# EAGLE design stm8-hid (EAGLE 6.5.0)
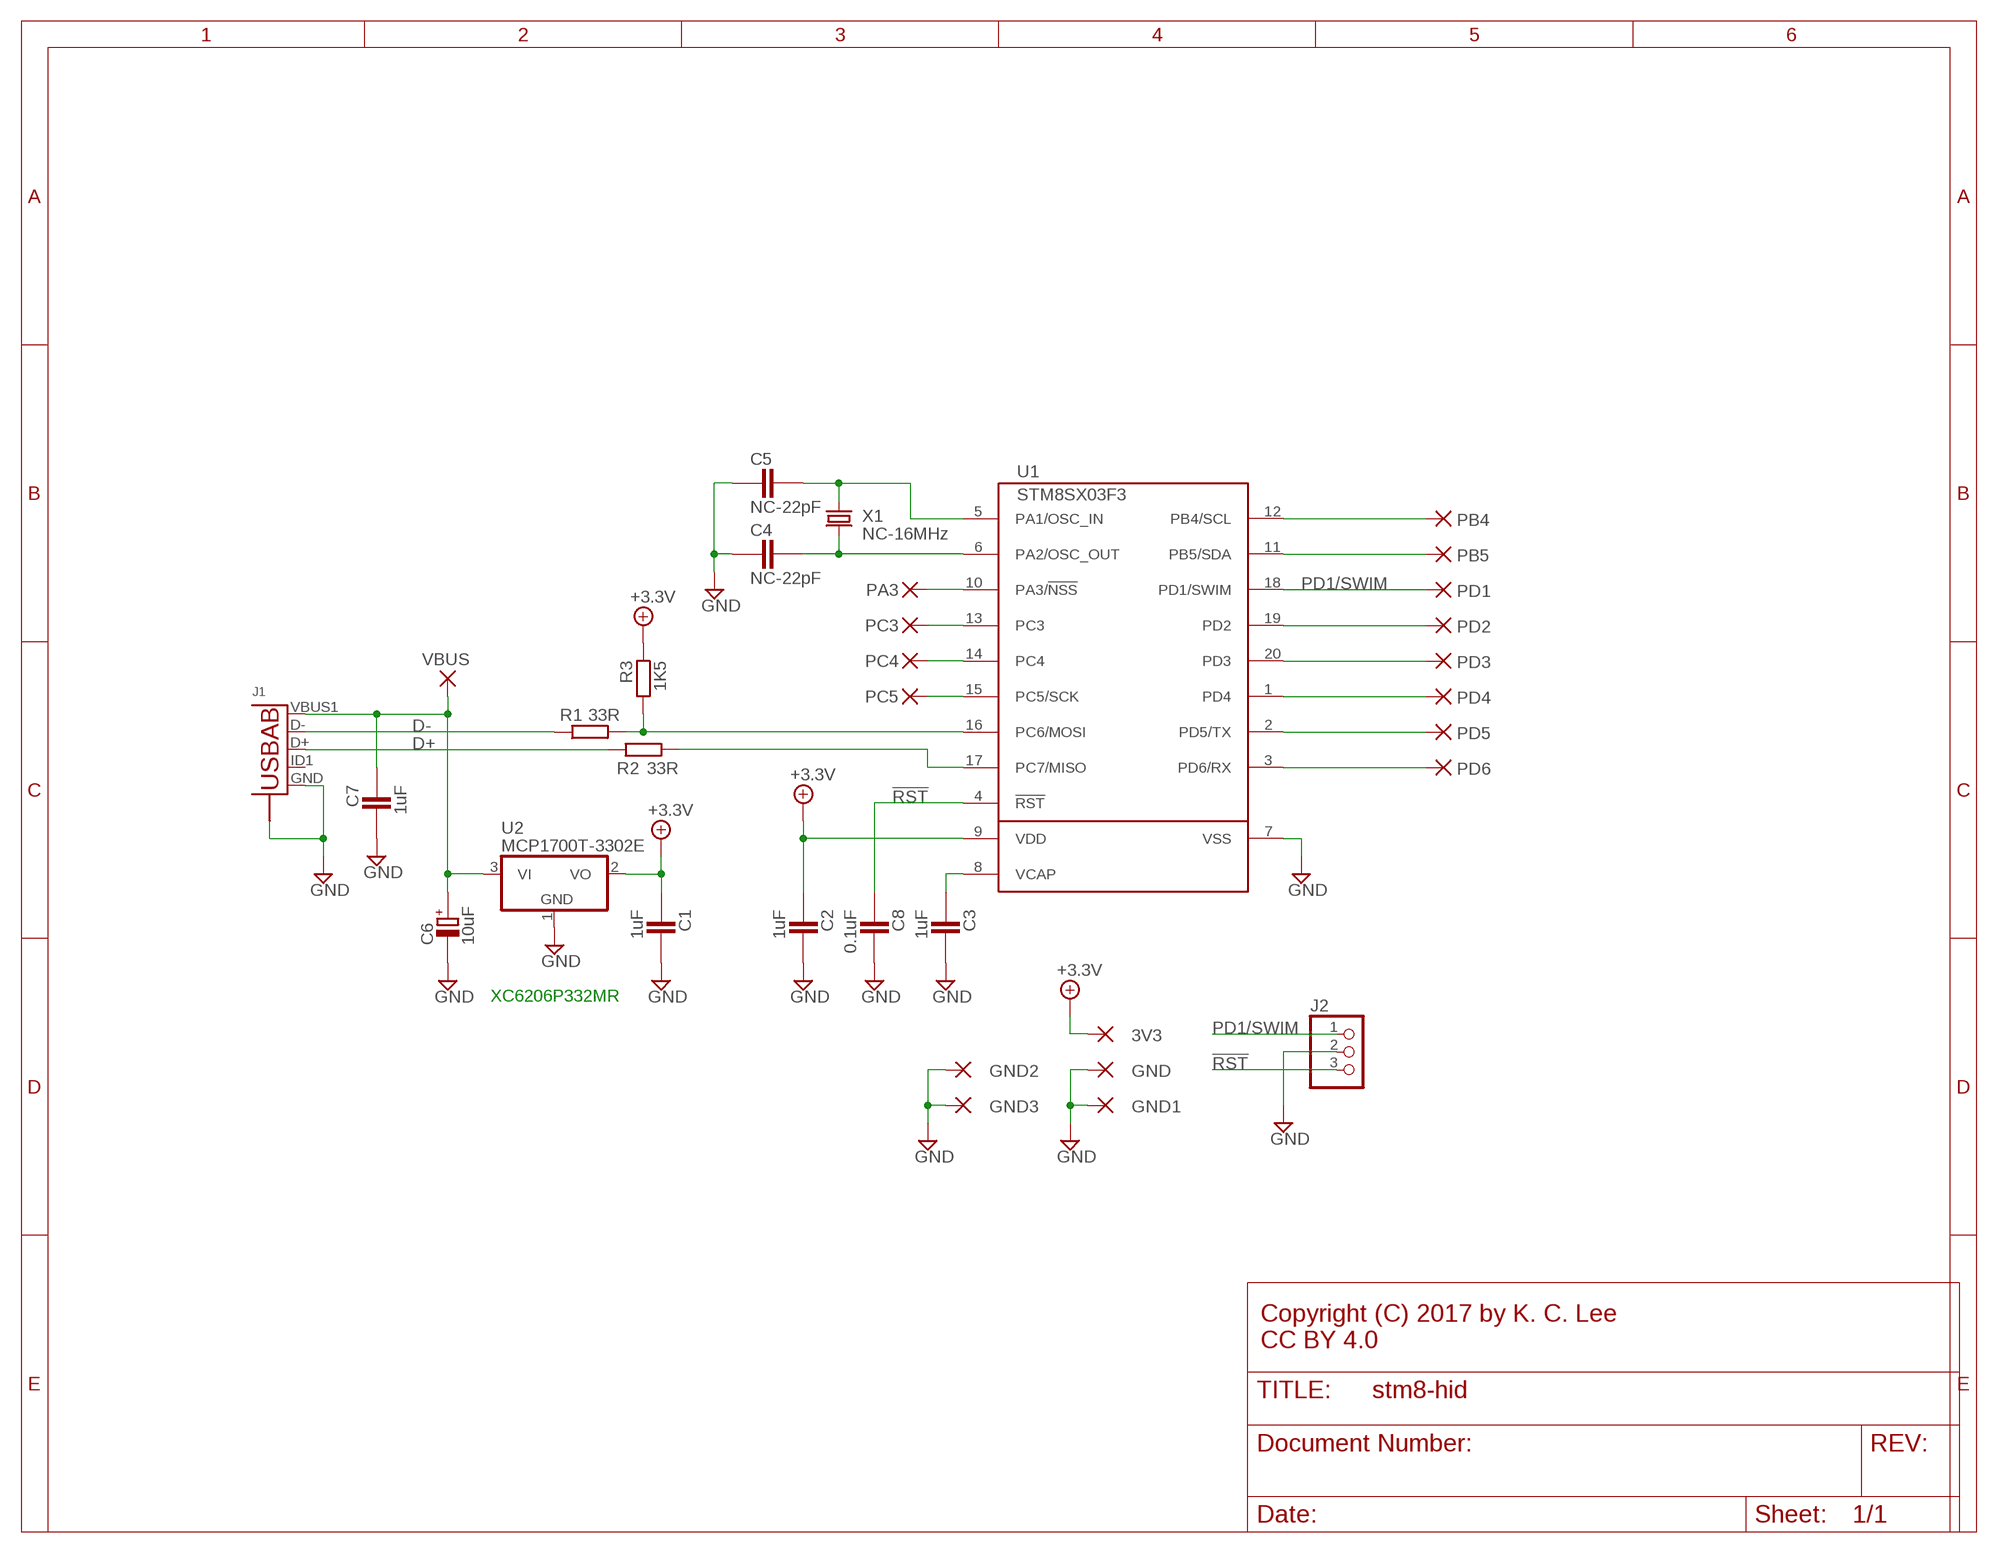
[diagram p0: schematic, sheet 1]

## Parts
3V3  SMD2  [SMD1,27-2,54]
C1  1uF  CAPACITOR_0603  [CAPC1608X92N]
C2  1uF  CAPACITOR_0603  [CAPC1608X92N]
C3  1uF  CAPACITOR_0603  [CAPC1608X92N]
C4  NC-22pF  CAPACITOR_0603  [CAPC1608X92N]
C5  NC-22pF  CAPACITOR_0603  [CAPC1608X92N]
C6  10uF  POLARISED_C_CASE  [CAPMP6032X280N]
C7  1uF  CAPACITOR_0603  [CAPC1608X92N]
C8  0.1uF  CAPACITOR_0603  [CAPC1608X92N]
GND  SMD2  [SMD1,27-2,54]
GND1  SMD2  [SMD1,27-2,54]
GND2  SMD2  [SMD1,27-2,54]
GND3  SMD2  [SMD1,27-2,54]
J1  USB-ABBG-ORG  [USB-AB-MICRO-SMD_V03_SMT]
J2  PINHD-1X3_2.54  [1X03]
PA3  SMD2  [SMD1,27-2,54]
PB4  SMD2  [SMD1,27-2,54]
PB5  SMD2  [SMD1,27-2,54]
PC3  SMD2  [SMD1,27-2,54]
PC4  SMD2  [SMD1,27-2,54]
PC5  SMD2  [SMD1,27-2,54]
PD1  SMD2  [SMD1,27-2,54]
PD2  SMD2  [SMD1,27-2,54]
PD3  SMD2  [SMD1,27-2,54]
PD4  SMD2  [SMD1,27-2,54]
PD5  SMD2  [SMD1,27-2,54]
PD6  SMD2  [SMD1,27-2,54]
R1  33R  RESISTOR_0603  [RESC1608X55N]
R2  33R  RESISTOR_0603  [RESC1608X55N]
R3  1K5  RESISTOR_0603  [RESC1608X55N]
U1  STM8SX03F3  [TSSOP20]
U2  MCP1700T-3302E  MCP1700/TT  [SOT95P280X135-3N]
VBUS  SMD2  [SMD1,27-2,54]
X1  NC-16MHz  XTAL_SMT  [TC38H]

## Nets
!RST: C8.1 J2.3 U1.4(!RST)
+3.3V: 3V3.1(P) C1.1 C2.1 R3.1 U1.9(VDD) U2.2(VO)
D+: J1.D+ R2.1
D-: J1.D- R1.1
GND: C1.2 C2.2 C3.2 C4.1 C5.1 C6.- C7.2 C8.2 GND1.1(P) GND2.1(P) GND3.1(P) GND.1(P) J1.GND J1.S1(S) J1.S2(S) J1.S3(S) J1.S4(S) J2.2 U1.7(VSS) U2.1(GND)
N$2: C3.1 U1.8(VCAP)
N$3: R2.2 U1.17(PC7/MISO)
N$4: R1.2 R3.2 U1.16(PC6/MOSI)
N$5: C4.2 U1.6(PA2/OSC_OUT) X1.2
N$6: C5.2 U1.5(PA1/OSC_IN) X1.1
N$7: PC5.1(P) U1.15(PC5/SCK)
N$8: PC4.1(P) U1.14(PC4)
N$9: PC3.1(P) U1.13(PC3)
N$10: PB4.1(P) U1.12(PB4/SCL)
N$11: PB5.1(P) U1.11(PB5/SDA)
N$12: PD2.1(P) U1.19(PD2)
N$13: PD3.1(P) U1.20(PD3)
N$14: PD4.1(P) U1.1(PD4)
N$15: PD5.1(P) U1.2(PD5/TX)
N$16: PD6.1(P) U1.3(PD6/RX)
N$17: PA3.1(P) U1.10(PA3/!NSS)
PD1/SWIM: J2.1 PD1.1(P) U1.18(PD1/SWIM)
VBUS: C6.+ C7.1 J1.VBUS1(VBUS) U2.3(VI) VBUS.1(P)
Unconnected: J1.ID1(USBID)

## Notes on the sheet
- XC6206P332MR
- Copyright (C) 2017 by K. C. Lee
  CC BY 4.0

## Library data of the parts
3V3 GND GND1-GND3 PA3 PB4 PB5 PC3-PC5 PD1-PD6 = wirepad:SMD2: SMD PAD
C1-C3 C8 = ipc-7351-capacitor:CAPACITOR_; PARTNO: 1uF X7R 0603
C4 C5 = ipc-7351-capacitor:CAPACITOR_; PARTNO: 22pF 0603
C6 = ipc-7351-capacitor:POLARISED_; PARTNO: 1uF X7R 0603
C7 = ipc-7351-capacitor:CAPACITOR_; PARTNO: NC 0805
J1 = Misc Conn:USB-AB: This is a USB AB connector that is compatible with USB OTG. i.e. this connector can serve as a host or device
J2 = pinhead-1:PINHD-1X3: PIN HEADER
R1 R2 = ipc-7351-resistor:RESISTOR_; PARTNO: 47R 0603
R3 = ipc-7351-resistor:RESISTOR_; PARTNO: 1K5 0603
U1 = Misc Processor:STM8SX03F
U2 = Misc Power:MCP1700; PARTNO: MCP1700T-3302E/TT
VBUS = wirepad:SMD2: SMD PAD; PARTNO: Breakout
X1 = Misc Clock:XTAL_: kHz RANGE CRYSTAL UNIT LOW PROFILE SMD Source: Epson Toyocom FC-12M.pdf; PARTNO: 16MHz Crystal TC26

## Board
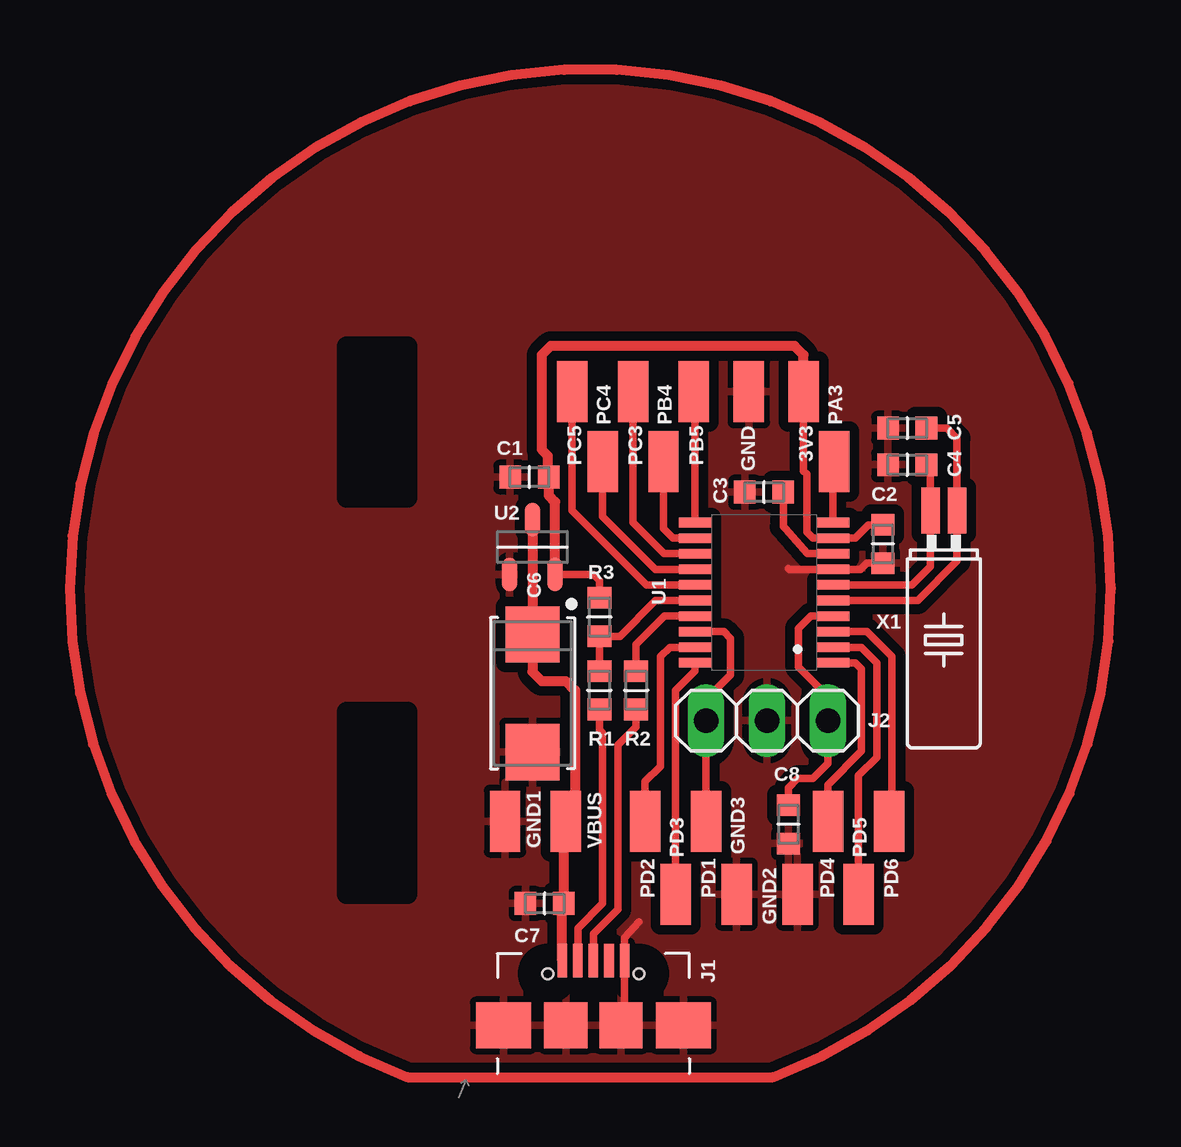
[diagram p1: board, top side]

No outline drawn. Coordinates in mm, seen from the top.
Copper layers (1*16): Top 0.035mm / dielectric 1.5mm / Bottom 0.035mm
Design rules "default *": minimum track width 10mil, minimum drill 24mil, track to track 8mil, track to pad 8mil, pad to pad 8mil, via to via 8mil, smd to smd 8mil, copper to edge 40mil, drill to drill 10mil, minimum pad ring 10mil, minimum via ring 8mil, stop-mask expansion 4mil, vias tented up to drill 0mil, thermal gap 10mil
tRestrict: 8 lines

### Footprints (pad centres in the part's own frame; a part is rotated, then mirrored left to right if it is on the bottom)
SMD1,27-2,54 = smd 1.27 x 2.54: 1 0,0
CAPC1608X92N = smd 0.9 x 0.95: 1 -0.8,0; 2 0.8,0
CAPMP6032X280N = smd 2.35 x 2.25: + -2.45,0; - 2.45,0
USB-AB-MICRO-SMD_V03_SMT = smd 1.4 x 0.4: D+ 2.7,0; D- 2.7,0.65; GND 2.7,-1.3; ID1 2.7,-0.65; VBUS1 2.7,1.3 | smd 1.9 x 2.3: S1 0,3.75; S4 0,-3.75 | smd 1.9 x 1.8: S2 0,1.15; S3 0,-1.15 | hole 0.45: 2.15,1.9; 2.15,-1.9
1X03 = drill 1.016 long: 1 -2.54,0; 2 0,0; 3 2.54,0
RESC1608X55N = smd 0.9 x 1: 1 -0.8,0; 2 0.8,0
TSSOP20 = smd 0.4 x 1.35: 1 -2.925,-2.875; 2 -2.275,-2.875; 3 -1.625,-2.875; 4 -0.975,-2.875; 5 -0.325,-2.875; 6 0.325,-2.875; 7 0.975,-2.875; 8 1.625,-2.875; 9 2.275,-2.875; 10 2.925,-2.875; 11 2.925,2.875; 12 2.275,2.875; 13 1.625,2.875; 14 0.975,2.875; 15 0.325,2.875; 16 -0.325,2.875; 17 -0.975,2.875; 18 -1.625,2.875; 19 -2.275,2.875; 20 -2.925,2.875
SOT95P280X135-3N = smd 1.4 x 0.65: 1 -1.15,0.95; 2 -1.15,-0.95; 3 1.15,0
TC38H = smd 0.762 x 1.905: 1 -0.55,0; 2 0.55,0

### Placement (x,y rotation side)
3V3  31.75,32.38 0 top
C1  20.32,28.83 180 top
C2  35.05,26.04 270 top
C3  30.1,28.19 180 top
C4  36.07,29.34 0 top
C5  36.07,30.86 0 top
C6  20.45,19.81 270 top
C7  20.95,11.05 180 top
C8  31.11,14.35 270 top
GND  29.46,32.38 0 top
GND1  19.3,14.48 0 top
GND2  31.5,11.43 0 top
GND3  28.96,11.43 0 top
J1  22.99,5.97 90 top
J2  30.23,18.67 0 top
PA3  33.02,29.46 180 top
PB4  25.91,29.46 180 top
PB5  27.18,32.38 180 top
PC3  24.64,32.38 180 top
PC4  23.37,29.46 0 top
PC5  22.1,32.38 0 top
PD1  27.69,14.48 0 top
PD2  25.15,14.48 180 top
PD3  26.42,11.43 180 top
PD4  32.77,14.48 180 top
PD5  34.04,11.43 180 top
PD6  35.31,14.48 180 top
R1  23.24,19.94 90 top
R2  24.77,19.94 90 top
R3  23.24,22.99 270 top
U1  30.1,24 90 top
U2  20.45,25.91 90 top
VBUS  21.84,14.48 180 top
X1  37.59,27.43 180 top

### Tracks (layer width: path | path; a pad name or v marks a point on that pad's centre or on a via)
!RST
  Top 0.305: U1.4 32.05,23.03 31.53,22.52 31.53,20.92 32.77,19.68 J2.3 32.77,16.89 32.13,16.26 31.5,16.26 31.11,15.88 C8.1
+3.3V
  Top 0.305: 35.11,26.9 C2.1 34.45,26.84 33.9,26.28 U1.9 32.14,26.28 31.88,26.54 31.88,28.96 31.75,29.08 3V3.1 | U2.2 22.99,24.76 23.24,24.51 R3.1
  Top 0.406: 3V3.1 31.75,33.91 31.37,34.29 21.21,34.29 20.83,33.91 20.83,29.97 21.08,29.72 21.08,28.99 C1.1 21.12,28.07 21.4,27.79 U2.2
D+
  Top 0.305: J1.D+ 22.99,9.78 24,10.79 24,17.65 24.77,18.41 R2.1
D-
  Top 0.305: J1.D- 22.34,10.02 23.37,11.05 23.37,18.16 23.24,18.29 R1.1
GND
  Top 0.305: J1.S3 24.29,6.12 J1.GND 24.29,9.62 24.89,10.29 | C2.2 34.38,25.23 34.12,24.98 U1.7 31.16,24.98 31.11,25.02
  pour Top (isolate 0.406): 45.72,46.99 45.72,0 0,0 0,46.99
N$1
  Top 0.406: 15.24,3.81 30.48,3.81 arc319 15.24,3.81
N$2
  Top 0.305: U1.8 31.9,25.63 30.99,26.67 30.9,26.76 C3.1
N$3
  Top 0.305: U1.17 25.95,23.03 24.77,21.84 R2.2
N$4
  Top 0.305: U1.16 25.58,23.68 24.09,22.19 R3.2 R1.2
N$5
  Top 0.305: U1.6 36.27,24.33 37.04,25.1 X1.2 37.04,29.16 C4.2
N$6
  Top 0.305: U1.5 36.51,23.68 38.14,25.32 X1.1 38.14,30.44 37.72,30.86 C5.2
N$7
  Top 0.305: U1.15 25.2,24.33 22.1,27.43 PC5.1
N$8
  Top 0.305: U1.14 25.57,24.98 23.37,27.18 PC4.1
N$9
  Top 0.305: U1.13 25.93,25.63 24.64,26.92 PC3.1
N$10
  Top 0.305: U1.12 26.3,26.28 25.91,26.67 PB4.1
N$11
  Top 0.305: U1.11 27.22,32.34 PB5.1
N$12
  Top 0.305: PD2.1 25.15,16.13 25.78,16.76 25.78,21.34 26.17,21.73 U1.19
N$13
  Top 0.305: PD3.1 26.42,19.94 27.22,20.75 U1.20
N$14
  Top 0.305: U1.1 33.91,21.08 34.16,20.83 34.16,17.4 32.77,16 PD4.1
N$15
  Top 0.305: U1.2 34.15,21.73 34.8,21.08 34.8,17.14 34.04,16.38 PD5.1
N$16
  Top 0.305: U1.3 34.39,22.38 35.43,21.34 35.43,14.61 PD6.1
N$17
  Top 0.305: U1.10 32.97,29.42 PA3.1
PD1/SWIM
  Top 0.305: PD1.1 J2.1 27.69,19.56 28.7,20.57 28.7,22.1 28.42,22.38 U1.18
VBUS
  Top 0.406: J1.VBUS1 21.69,11.21 21.75,11.27 C7.1 21.75,14.13 VBUS.1 22.23,14.61 22.23,19.94 21.84,20.32 20.83,20.32 20.45,20.7 C6.+ U2.3